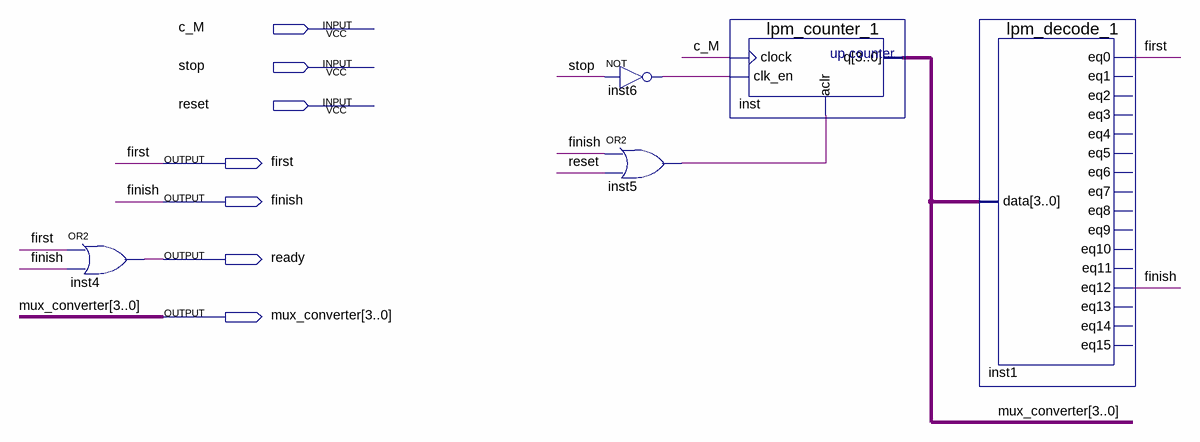
[diagram p0: schematic sheet]
// Quartus schematic make_ready_scheme_mux.bdf as structural Verilog: 5 symbols, 7 pins
module make_ready_scheme_mux (
  input  c_M,
  input  stop,
  input  reset,
  output first,
  output finish,
  output ready,
  output [3:0] mux_converter
);

  wire inst5_out, inst6_out;

  or inst4 (ready, first, finish);
  not inst6 (inst6_out, stop);
  or inst5 (inst5_out, finish, reset);
  lpm_counter_1 inst (.clock(c_M), .clk_en(inst6_out), .aclr(inst5_out), .q(mux_converter));
  lpm_decode_1 inst1 (
    .data(mux_converter), .eq0(first), .eq12(finish));  // open: eq1, eq2, eq3, eq4, eq5, eq6, eq7, eq8, eq9, eq10, eq11, eq13, eq14, eq15
endmodule
